# EAGLE design EVALBOARD_001 (EAGLE 7.7.0)

## Sheet 1 of 4
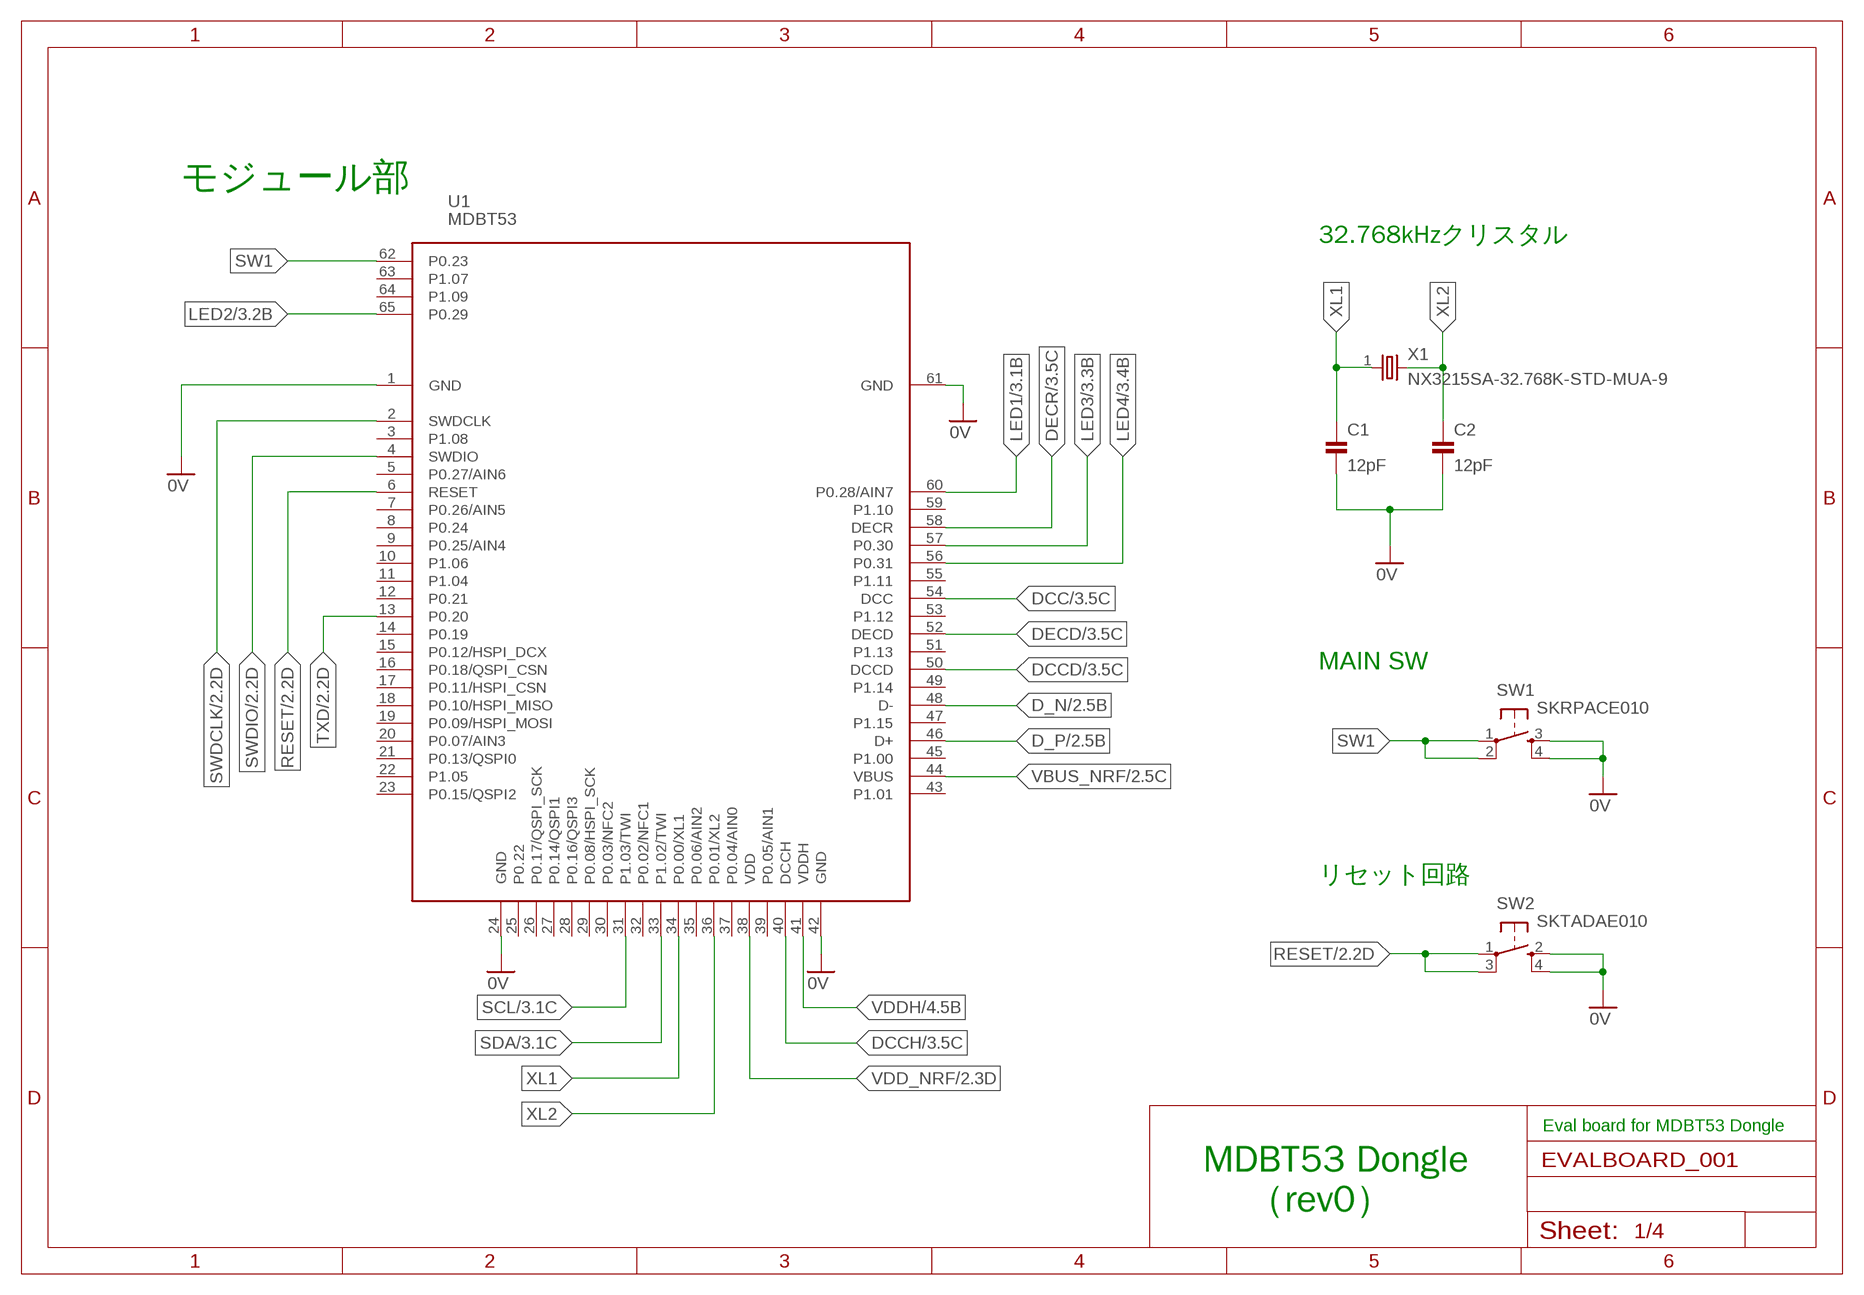
[diagram p0: schematic, sheet 1]

### Parts
C1  12pF  CAP_0603  [C0603K]
C2  12pF  CAP_0603  [C0603K]
SW1  SKRPACE010  [SKRPACE010]
SW2  SKTADAE010  [SKTADAE010]
U1  MDBT53  [MDBT53]
X1  NX3215SA-32.768K-STD-MUA-9  [NX3215]

### Nets
0V: C1.2 C2.2 SW1.3(S) SW1.4(S1) SW2.2(S) SW2.4(S1) U1.1(GND) U1.24(GND) U1.42(GND) U1.61(GND) ; also sheet 2,3,4
D_N: U1.48(D-) ; also sheet 2
D_P: U1.46(D+) ; also sheet 2
DCC: U1.54(DCC) ; also sheet 3
DCCD: U1.50(DCCD) ; also sheet 3
DCCH: U1.40(DCCH) ; also sheet 3
DECD: U1.52(DECD) ; also sheet 3
DECR: U1.58(DECR) ; also sheet 3
LED1: U1.60(P0.28/AIN7) ; also sheet 3
LED2: U1.65(P0.29) ; also sheet 3
LED3: U1.57(P0.30) ; also sheet 3
LED4: U1.56(P0.31) ; also sheet 3
RESET: SW2.1(P) SW2.3(P1) U1.6(RESET) ; also sheet 2
SCL: U1.31(P1.03/TWI) ; also sheet 3
SDA: U1.33(P1.02/TWI) ; also sheet 3
SW1: SW1.1(P) SW1.2(P1) U1.62(P0.23)
SWDCLK: U1.2(SWDCLK) ; also sheet 2
SWDIO: U1.4(SWDIO) ; also sheet 2
TXD: U1.13(P0.20) ; also sheet 2
VBUS_NRF: U1.44(VBUS) ; also sheet 2
VDD_NRF: U1.38(VDD) ; also sheet 2,3,4
VDDH: U1.41(VDDH) ; also sheet 4
XL1: C1.1 U1.34(P0.00/XL1) X1.1
XL2: C2.1 U1.36(P0.01/XL2) X1.2
Unconnected: U1.3(P1.08) U1.5(P0.27/AIN6) U1.7(P0.26/AIN5) U1.8(P0.24) U1.9(P0.25/AIN4) U1.10(P1.06) U1.11(P1.04) U1.12(P0.21) U1.14(P0.19) U1.15(P0.12/HSPI_DCX) U1.16(P0.18/QSPI_CSN) U1.17(P0.11/HSPI_CSN) U1.18(P0.10/HSPI_MISO) U1.19(P0.09/HSPI_MOSI) U1.20(P0.07/AIN3) U1.21(P0.13/QSPI0) U1.22(P1.05) U1.23(P0.15/QSPI2) U1.25(P0.22) U1.26(P0.17/QSPI_SCK) U1.27(P0.14/QSPI1) U1.28(P0.16/QSPI3) U1.29(P0.08/HSPI_SCK) U1.30(P0.03/NFC2) U1.32(P0.02/NFC1) U1.35(P0.06/AIN2) U1.37(P0.04/AIN0) U1.39(P0.05/AIN1) U1.43(P1.01) U1.45(P1.00) U1.47(P1.15) U1.49(P1.14) U1.51(P1.13) U1.53(P1.12) U1.55(P1.11) U1.59(P1.10) U1.63(P1.07) U1.64(P1.09)

### Notes on the sheet
- モジュール部
- 32.768kHzクリスタル
- MAIN SW
- リセット回路
- Eval board for MDBT53 Dongle
- MDBT53 Dongle
      （rev0）

## Sheet 2 of 4
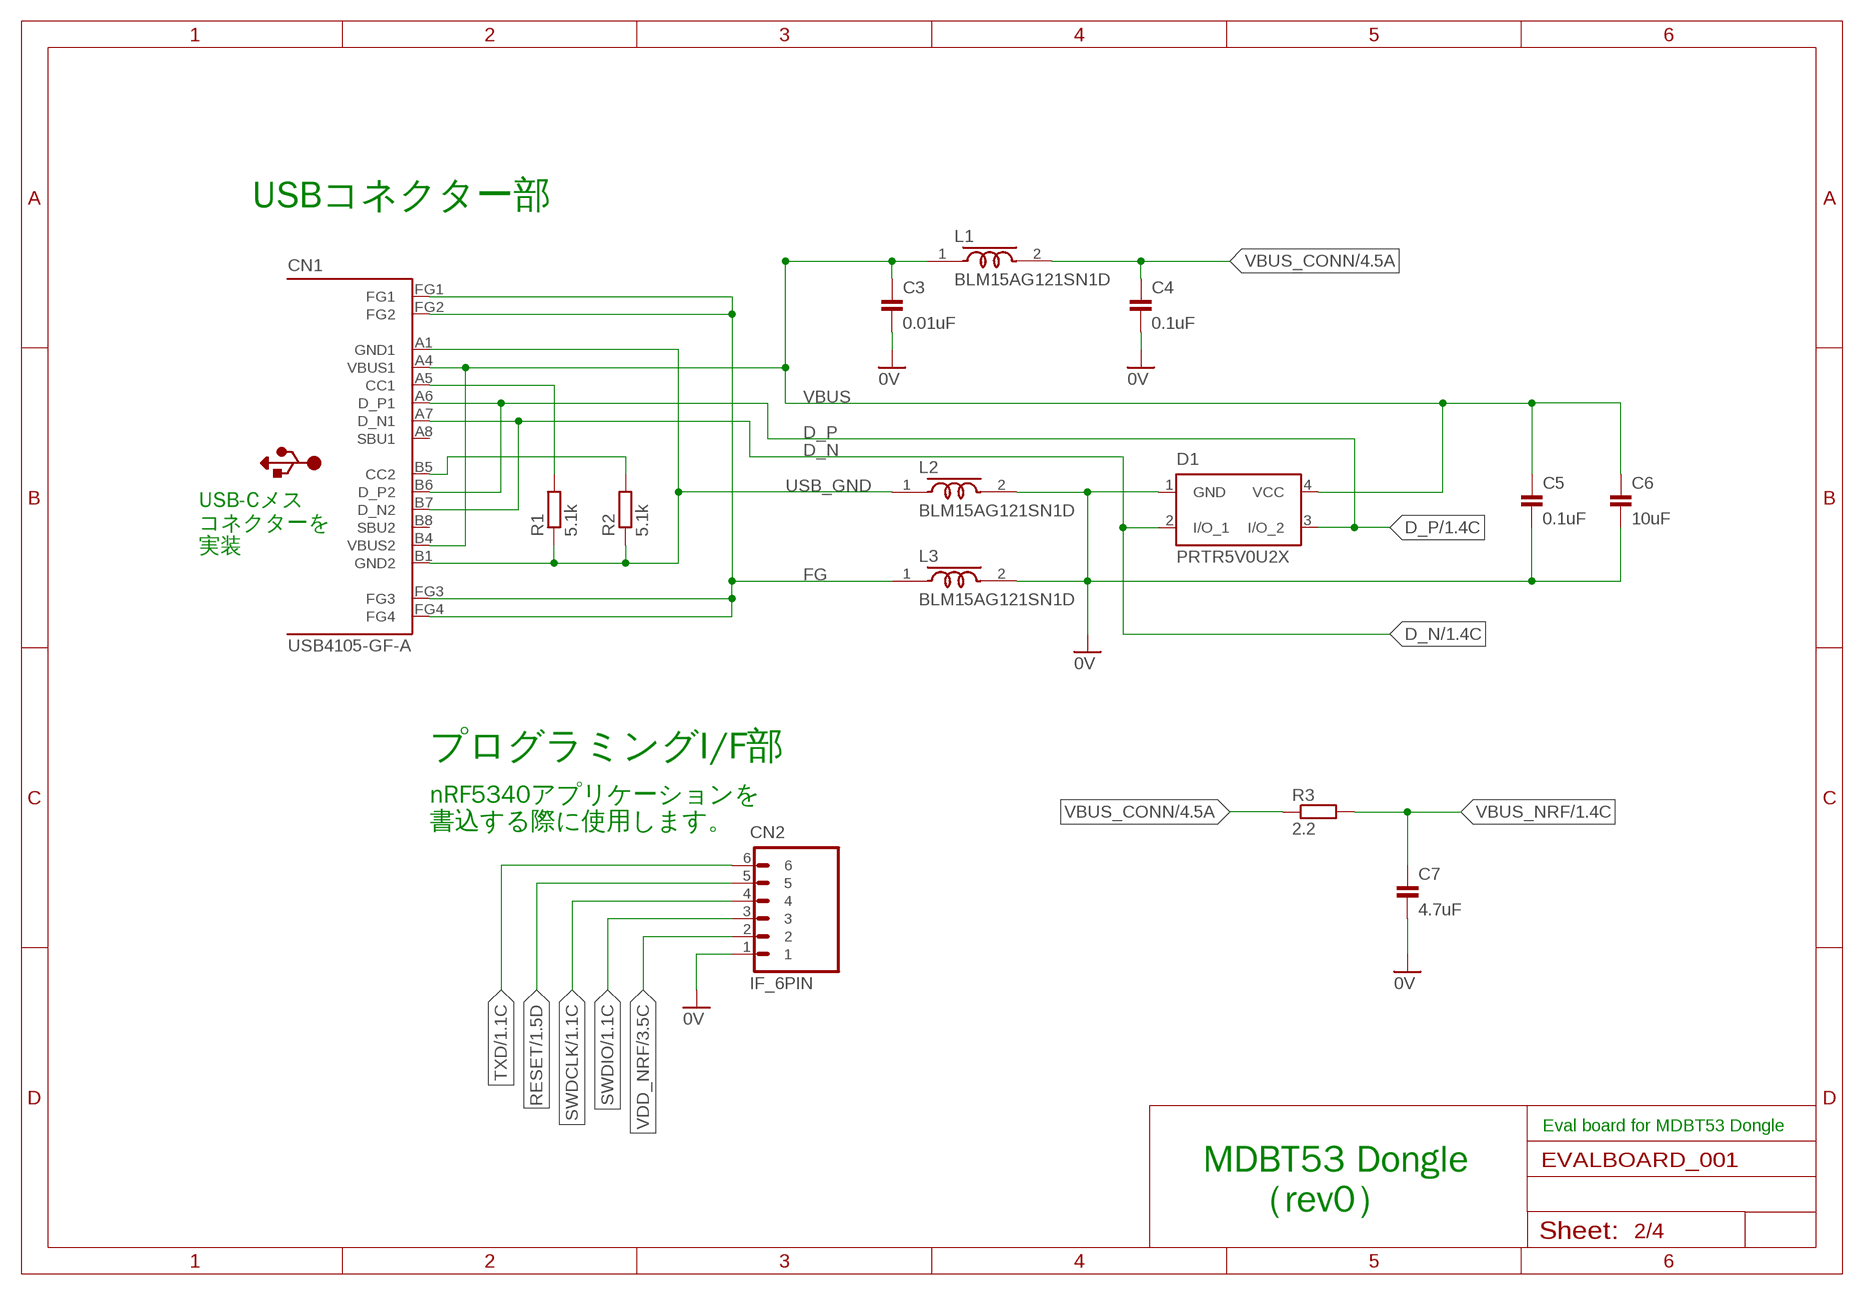
[diagram p1: schematic, sheet 2]

### Parts
C3  0.01uF  CAP_0402K  [C0402K]
C4  0.1uF  CAP_0402K  [C0402K]
C5  0.1uF  CAP_0402K  [C0402K]
C6  10uF  CAP_0603  [C0603K]
C7  4.7uF  CAP_0603  [C0603K]
CN1  USB4105-GF-A  [USB4105-GF-A]
CN2  IF_6PIN  [HEADER_6PIN]
D1  PRTR5V0U2X  [SOT143B]
L1  BLM15AG121SN1D  [C0402K]
L2  BLM15AG121SN1D  [C0402K]
L3  BLM15AG121SN1D  [C0402K]
R1  5.1k  RESISTOR_0402N  [R0402N]
R2  5.1k  RESISTOR_0402N  [R0402N]
R3  2.2  RESISTOR_0402  [R0402]

### Nets
0V: C3.2 C4.2 C5.2 C6.2 C7.2 CN2.1 D1.1(GND) L2.2 L3.2 ; also sheet 1,3,4
D_N: CN1.A7(D_N1) CN1.B7(D_N2) D1.2(I/O_1) ; also sheet 1
D_P: CN1.A6(D_P1) CN1.B6(D_P2) D1.3(I/O_2) ; also sheet 1
FG: CN1.FG1 CN1.FG2 CN1.FG3 CN1.FG4 L3.1
N$2: CN1.A5(CC1) R1.2
N$3: CN1.B5(CC2) R2.2
RESET: CN2.5 ; also sheet 1
SWDCLK: CN2.4 ; also sheet 1
SWDIO: CN2.3 ; also sheet 1
TXD: CN2.6 ; also sheet 1
USB_GND: CN1.A1(GND1) CN1.B1(GND2) L2.1 R1.1 R2.1
VBUS: C3.1 C5.1 C6.1 CN1.A4(VBUS1) CN1.B4(VBUS2) D1.4(VCC) L1.1
VBUS_CONN: C4.1 L1.2 R3.1 ; also sheet 4
VBUS_NRF: C7.1 R3.2 ; also sheet 1
VDD_NRF: CN2.2 ; also sheet 1,3,4
Unconnected: CN1.A8(SBU1) CN1.B8(SBU2)

### Notes on the sheet
- USBコネクター部
- USB-Cメス
  コネクターを
  実装
- プログラミングI/F部
- nRF5340アプリケーションを
  書込する際に使用します。
- Eval board for MDBT53 Dongle
- MDBT53 Dongle
      （rev0）

## Sheet 3 of 4
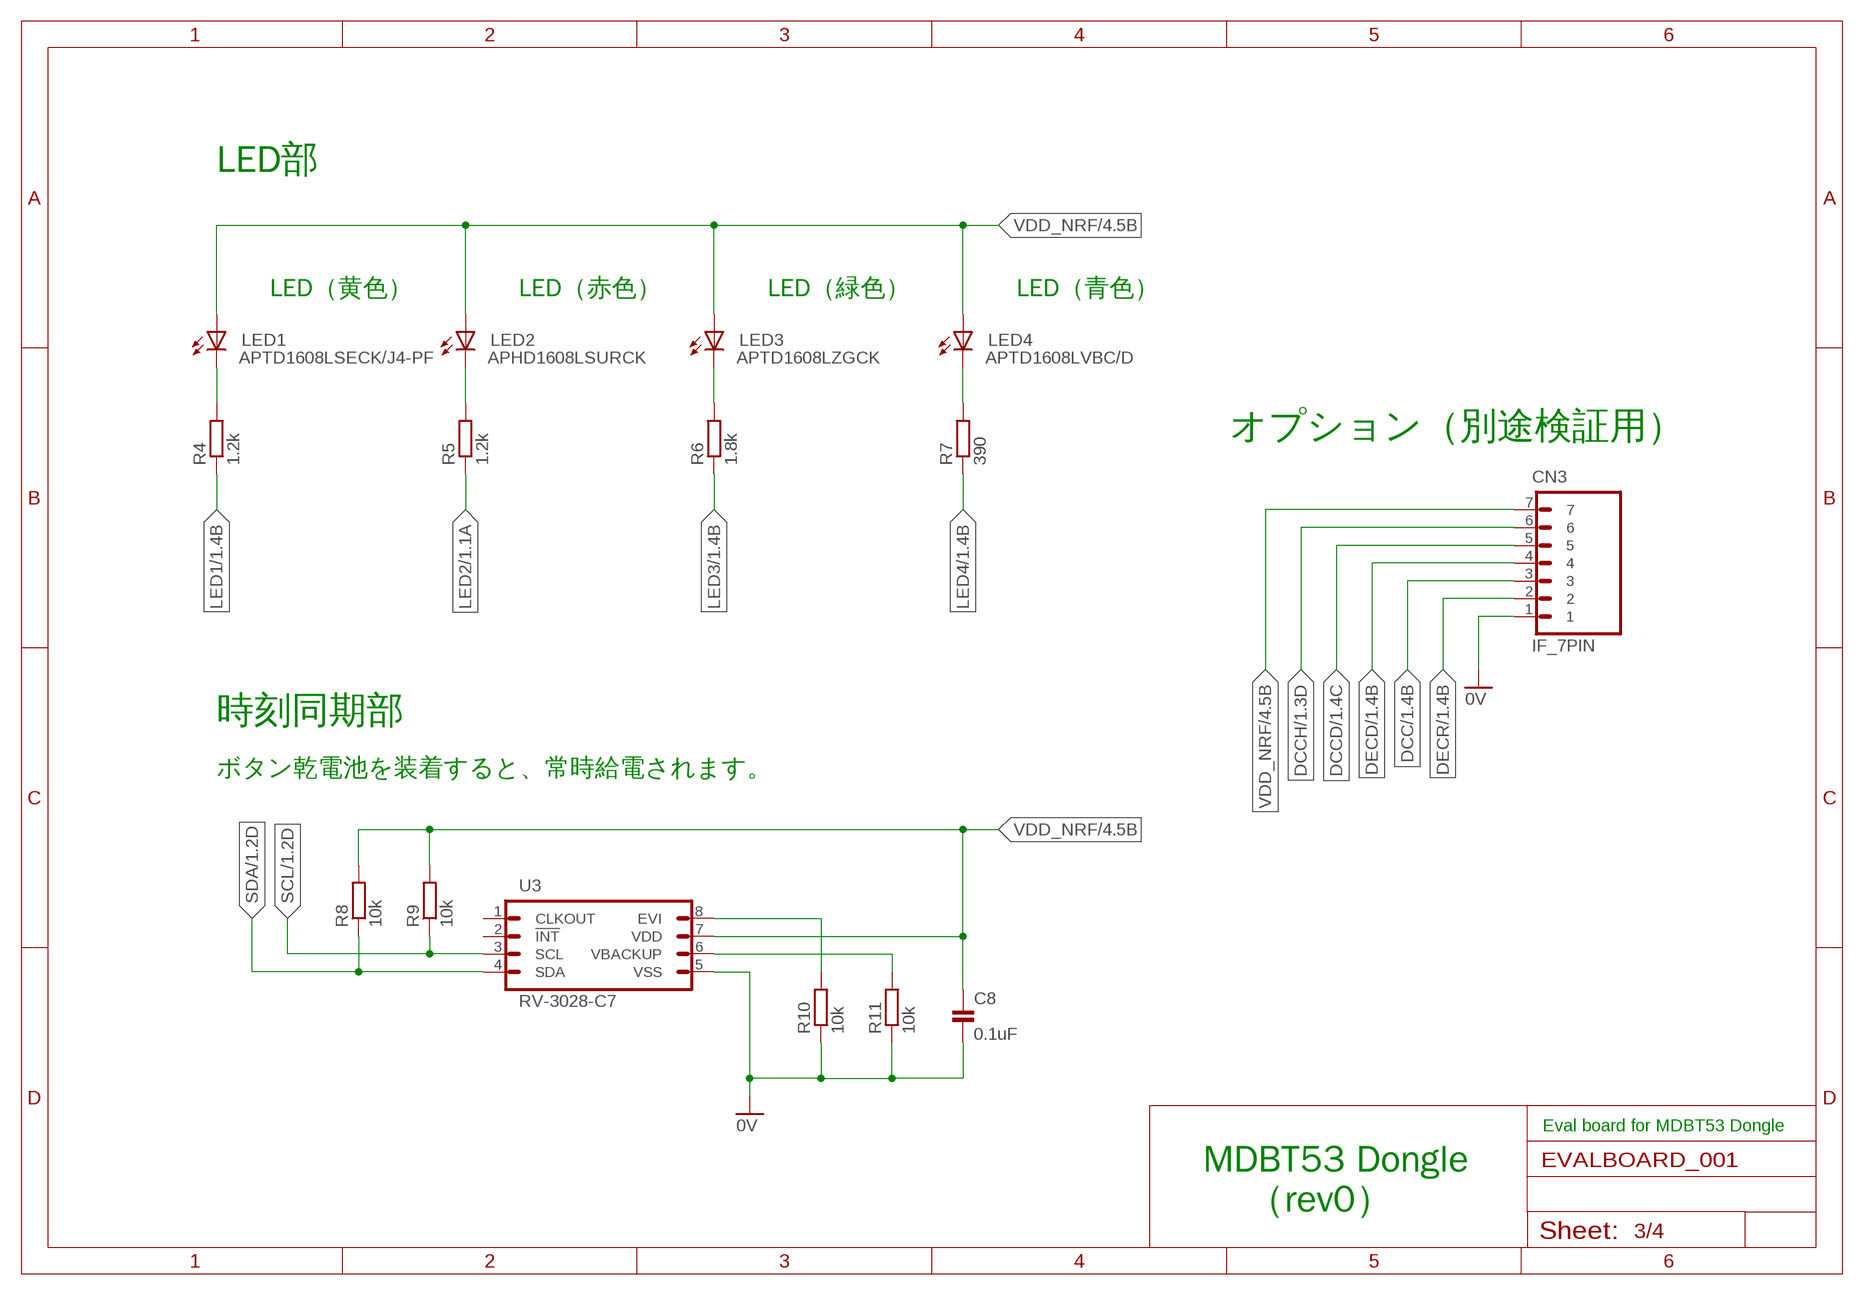
[diagram p2: schematic, sheet 3]

### Parts
C8  0.1uF  CAP_0402K  [C0402K]
CN3  IF_7PIN  [HEADER_7PIN]
LED1  APTD1608LSECK/J4-PF  [APTD1608]
LED2  APHD1608LSURCK  [APTD1608]
LED3  APTD1608LZGCK  [APTD1608]
LED4  APTD1608LVBC/D  [APTD1608]
R4  1.2k  RESISTOR_0402N  [R0402N]
R5  1.2k  RESISTOR_0402N  [R0402N]
R6  1.8k  RESISTOR_0402N  [R0402N]
R7  390  RESISTOR_0402N  [R0402N]
R8  10k  RESISTOR_0402N  [R0402N]
R9  10k  RESISTOR_0402N  [R0402N]
R10  10k  RESISTOR_0402N  [R0402N]
R11  10k  RESISTOR_0402N  [R0402N]
U3  RV-3028-C7  [SON-8]

### Nets
0V: C8.2 CN3.1 R10.1 R11.1 U3.5(VSS) ; also sheet 1,2,4
DCC: CN3.3 ; also sheet 1
DCCD: CN3.5 ; also sheet 1
DCCH: CN3.6 ; also sheet 1
DECD: CN3.4 ; also sheet 1
DECR: CN3.2 ; also sheet 1
LED1: R4.1 ; also sheet 1
LED2: R5.1 ; also sheet 1
LED3: R6.1 ; also sheet 1
LED4: R7.1 ; also sheet 1
N$1: LED4.C R7.2
N$6: LED3.C R6.2
N$7: LED2.C R5.2
N$8: LED1.C R4.2
N$9: R11.2 U3.6(VBACKUP)
N$10: R10.2 U3.8(EVI)
SCL: R9.1 U3.3(SCL) ; also sheet 1
SDA: R8.1 U3.4(SDA) ; also sheet 1
VDD_NRF: C8.1 CN3.7 LED1.A LED2.A LED3.A LED4.A R8.2 R9.2 U3.7(VDD) ; also sheet 1,2,4
Unconnected: U3.1(CLKOUT) U3.2(!INT!)

### Notes on the sheet
- LED部
- LED（黄色） | LED（赤色） | LED（緑色） | LED（青色）
- オプション（別途検証用）
- 時刻同期部
- ボタン乾電池を装着すると、常時給電されます。
- Eval board for MDBT53 Dongle
- MDBT53 Dongle
      （rev0）

## Sheet 4 of 4
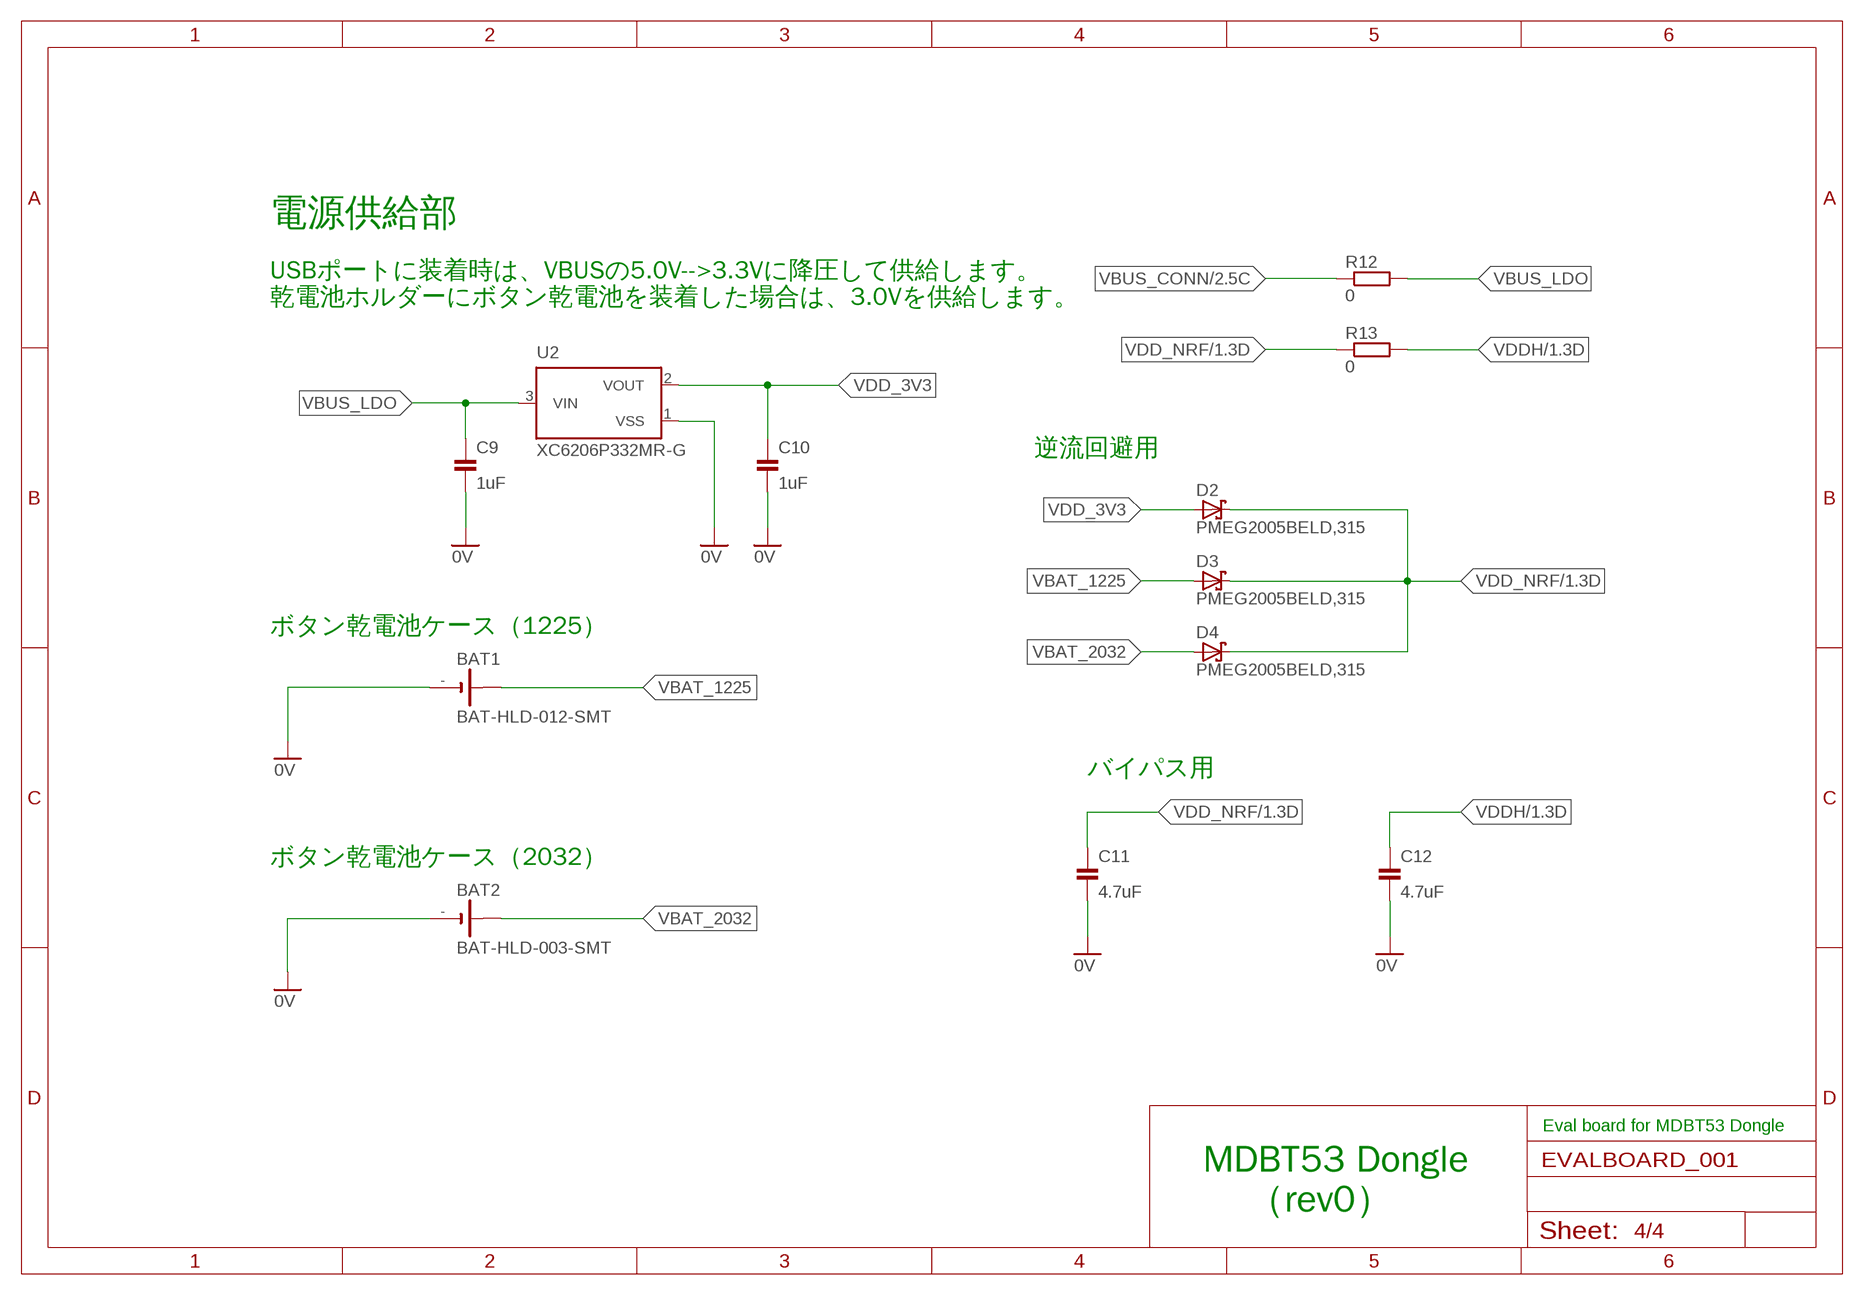
[diagram p3: schematic, sheet 4]

### Parts
BAT1  BAT-HLD-012-SMT  [BAT-HLD-012-SMT]
BAT2  BAT-HLD-003-SMT  [BAT-HLD-003-SMT]
C9  1uF  CAP_0603  [C0603K]
C10  1uF  CAP_0603  [C0603K]
C11  4.7uF  CAP_0603  [C0603K]
C12  4.7uF  CAP_0603  [C0603K]
D2  PMEG2005BELD,315  [DFN1006D-2]
D3  PMEG2005BELD,315  [DFN1006D-2]
D4  PMEG2005BELD,315  [DFN1006D-2]
R12  0  RESISTOR_0603  [R0603]
R13  0  RESISTOR_0603  [R0603]
U2  XC6206P332MR-G  [SOT23]

### Nets
0V: BAT1.- BAT2.- C9.2 C10.2 C11.2 C12.2 U2.1(VSS) ; also sheet 1,2,3
VBAT_1225: BAT1.+@2(+) D3.2(A)
VBAT_2032: BAT2.+@1(+) D4.2(A)
VBUS_CONN: R12.1 ; also sheet 2
VBUS_LDO: C9.1 R12.2 U2.3(VIN)
VDD_3V3: C10.1 D2.2(A) U2.2(VOUT)
VDD_NRF: C11.1 D2.1(C) D3.1(C) D4.1(C) R13.1 ; also sheet 1,2,3
VDDH: C12.1 R13.2 ; also sheet 1

### Notes on the sheet
- 電源供給部
- USBポートに装着時は、VBUSの5.0V-->3.3Vに降圧して供給します。
  乾電池ホルダーにボタン乾電池を装着した場合は、3.0Vを供給します。
- 逆流回避用
- ボタン乾電池ケース（1225）
- バイパス用
- ボタン乾電池ケース（2032）
- Eval board for MDBT53 Dongle
- MDBT53 Dongle
      （rev0）

## Library data of the parts
BAT1 = Connectors:BAT-HLD-012-SMT: ボタン電池ホルダー(CR1216/1225)
BAT2 = Connectors:BAT-HLD-003-SMT: ボタン電池ホルダー(CR2025/2032)
C1-C12 = Parts:CAP: コンデンサー
CN1 = Connectors:USB4105-GF-A: USB Type C Receptacle for USB 2.0
CN2 = Connectors:IF_6PIN: 6-pin インターフェース
CN3 = Connectors:IF_7PIN: 7-pin インターフェース
D1 = Parts:PRTR5V0U2X: ESD protection diode
D2-D4 = Parts:PMEG2005: ショットキーダイオード If - 順電流: 500 mA Vrrm - 繰返し逆電圧: 20 V Vf - 順電圧: 0.39 V Ifsm - 順方向サージ電流: 10 A 最低動作温度: - 65 C 最高動作温度: + 150 C
L1-L3 = Parts:BLM15AG: フェライトビーズ EMIFIL®
LED1 LED3 LED4 = Parts:APTD1608: 発光ダイオード
LED2 = Parts:APHD1608: 発光ダイオード
R1-R13 = Parts:RESISTOR: 抵抗器
SW1 = Parts:SKRPACE010: 表面実装用タクトスイッチ ４．２×３．２ｍｍ小型重作動力タイプ ・作動力：２．５５Ｎ ・操作方向：垂直 ・移動量：０．２ｍｍ ・動作寿命：５０，０００ｃｙｃｌｅｓ （５ｍＡ ５ＶＤＣ） ・初期接触抵抗：最大５００ｍΩ
SW2 = Parts:SKTADAE010: 表面実装用タクトスイッチ 2.6×1.6ｍｍ小型重作動力タイプ ・作動力：2.4 N ・操作方向：垂直 ・移動量：0.11 mm ・定格：50 mA 12 VDC
U1 = Modules:MDBT53: Raytac Corporation Part Number: MDBT53-1M / MDBT53-P1M / MDBT53-U1M Bluetooth Low Energy Module based on Noridc nRF5340 Size: 14.3x9.3mm Source: Raytac datasheet
U2 = Parts:XC6206: 電圧レギュレータ 出力電圧: 3.3 V 出力電流: 200 mA 入力電圧最大値: 6 V 最小入力電圧: 1.8 V 動作供給電流: 1 uA 最低動作温度: - 40 C 最高動作温度: + 85 C
U3 = ICs:RV-3028-C7: Extreme Low Power RTC Module Supply Voltage: 1.2 V 〜 5.5 V Operating Temperature: - 40 C 〜 + 85 C 3.2 mm x 1.5 mm
X1 = Parts:NX3215SA: 水晶振動子 周波数 32.768kHz 周波数公差 ±20ppm 負荷容量 6pF ESR（等価直列抵抗） 70 kOhms 動作温度 -40°C～85°C

## Board
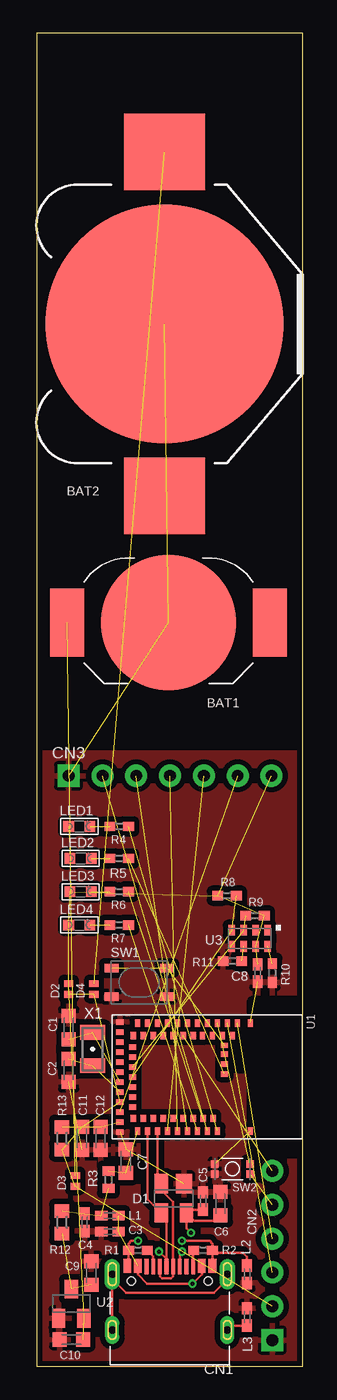
[diagram p4: board, top side]
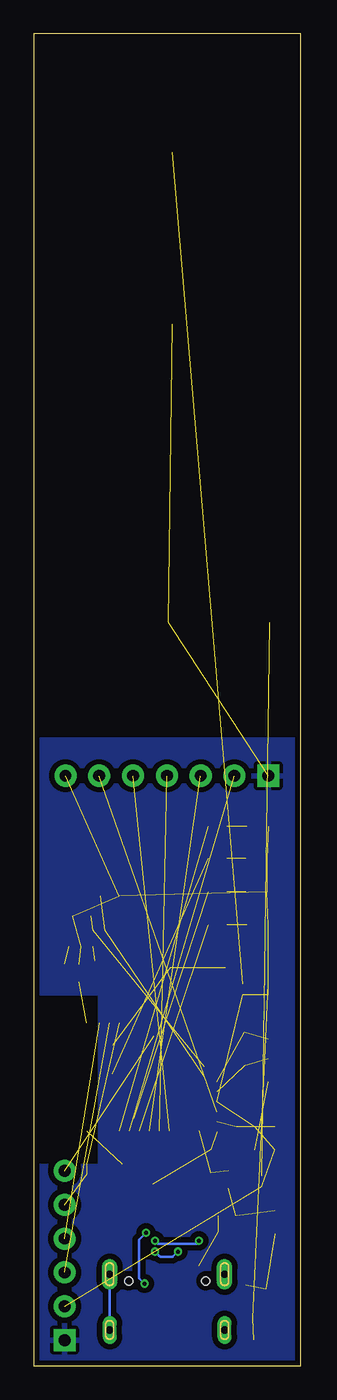
[diagram p5: board, bottom side, seen from below]

Size 20 x 100 mm. Coordinates in mm from the lower left corner, seen from the top.
Outline: 0,0 20,0 20,100 0,100 0,0
Copper layers (1*16): Top 0.035mm / dielectric 1.5mm / Bottom 0.035mm
Design rules "SeeedStudio_2layer_DRU_no_angle_20140221 *": minimum track width 6mil, minimum drill 0.3mm, track to track 6mil, track to pad 6mil, pad to pad 6mil, via to via 6mil, smd to smd 0mil, copper to edge 10mil, drill to drill 10mil, minimum pad ring 10mil, minimum via ring 6mil, stop-mask expansion 2mil, vias tented up to drill 100mil, thermal gap 10mil

### Footprints (pad centres in the part's own frame; a part is rotated, then mirrored left to right if it is on the bottom)
BAT-HLD-012-SMT = smd 2.54 x 5.08: +@1 -7.62,0; +@2 7.62,0 | smd 10.16 x 10.16: - 0,0
BAT-HLD-003-SMT = smd 5.7 x 6.1: +@1 -12.9,0; +@2 12.9,0 | smd 17.9 x 17.9: - 0,0
C0603K = smd 1.05 x 1.08: 1 -0.875,0; 2 0.875,0
C0402K = smd 0.925 x 0.74: 1 -0.65,0; 2 0.65,0
USB4105-GF-A = smd 0.58 x 1.05: A1 -3.2,0.625; A4 -2.4,0.625; B1 3.2,0.625; B4 2.4,0.625 | smd 0.28 x 1.15: A5 -1.25,0.575; A6 -0.25,0.575; A7 0.25,0.575; A8 1.25,0.575; B5 1.75,0.575; B6 0.75,0.575; B7 -0.75,0.575; B8 -1.75,0.575 | drill 0.55 pad 1.15 long: FG1 -4.32,0; FG3 4.32,0 | drill 0.55 pad 1.05 long: FG2 -4.32,-4.18; FG4 4.32,-4.18 | hole 0.6: -2.89,-0.5; 2.89,-0.5
HEADER_6PIN = drill 0.889 pad 1.651 square: 1 -6.35,0 | drill 0.889 pad 1.651: 2 -3.81,0; 3 -1.27,0; 4 1.27,0; 5 3.81,0; 6 6.35,0
HEADER_7PIN = drill 0.889 pad 1.651 square: 1 0,0 | drill 0.889 pad 1.651: 2 2.54,0; 3 5.08,0; 4 7.62,0; 5 10.16,0; 6 12.7,0; 7 15.24,0
SOT143B = smd 1.2 x 1.44: 1 -0.75,-1.1 | smd 1 x 1.44: 2 0.95,-1.1; 3 0.95,1.1; 4 -0.95,1.1
DFN1006D-2 = smd 0.5 x 0.7: 1 -0.4,0; 2 0.4,0
APTD1608 = smd 0.8 x 0.8: A -0.8,0; C 0.8,0
R0402N = smd 0.8 x 0.7: 1 -0.7,0; 2 0.7,0
R0402 = smd 0.7 x 0.9: 1 -0.65,0; 2 0.65,0
R0603 = smd 1 x 1.1: 1 -0.85,0; 2 0.85,0
SKRPACE010 = smd 1.05 x 0.65: 1 -2.075,1.075; 2 2.075,1.075; 3 -2.075,-1.075; 4 2.075,-1.075
SKTADAE010 = smd 0.55 x 0.55: 1 -1.325,0.375; 2 1.325,0.375; 3 -1.325,-0.375; 4 1.325,-0.375
MDBT53 = smd 0.55 x 0.4: 1 -4.05,3.25; 2 -4.05,2.275; 3 -3.1,1.9; 4 -4.05,1.525; 5 -3.1,1.15; 6 -4.05,0.775; 7 -3.1,0.4; 8 -4.05,0.025; 9 -3.1,-0.35; 10 -4.05,-0.725; 11 -3.1,-1.05; 12 -4.05,-1.475; 13 -3.1,-1.8; 14 -4.05,-2.225; 15 -3.1,-2.55; 16 -4.05,-2.975; 17 -3.1,-3.3; 18 -4.05,-3.725; 19 -3.1,-4.05; 20 -4.05,-4.475; 21 -3.1,-4.8; 22 -4.05,-5.225; 23 -3.1,-5.55; 43 3.1,-5.55; 44 4.05,-5.225; 45 3.1,-4.8; 46 4.05,-4.475; 47 3.1,-4.05; 48 4.05,-3.725; 49 3.1,-3.3; 50 4.05,-2.975; 51 3.1,-2.55; 52 4.05,-2.225; 53 3.1,-1.8; 54 4.05,-1.475; 55 3.1,-1.05; 56 4.05,-0.725; 57 3.1,-0.3; 58 4.05,0.025; 59 3.1,0.45; 60 4.05,0.775; 61 4.05,3.25 | smd 0.4 x 0.55: 24 -4.125,-6.55; 25 -3.375,-6.55; 26 -2.625,-6.55; 27 -2.25,-5.6; 28 -1.875,-6.55; 29 -1.5,-5.6; 30 -1.125,-6.55; 31 -0.75,-5.6; 32 -0.375,-6.55; 33 0,-5.6; 34 0.375,-6.55; 35 0.75,-5.6; 36 1.125,-6.55; 37 1.5,-5.6; 38 1.875,-6.55; 39 2.25,-5.6; 40 2.625,-6.55; 41 3.375,-6.55; 42 4.125,-6.55; 62 -2.375,1.3; 63 -1.725,1.3; 64 -0.975,1.3; 65 -0.225,1.3
SOT23 = smd 1 x 1.4: 1 -0.95,-1.1; 2 0.95,-1.1; 3 0,1.1
SON-8 = smd 0.5 x 0.8: 1 0.25,0.4; 2 1.15,0.4; 3 2.05,0.4; 4 2.95,0.4; 5 2.95,1.6; 6 2.05,1.6; 7 1.15,1.6; 8 0.25,1.6
NX3215 = smd 1.1 x 1.9: 1 -1.25,0; 2 1.25,0

### Placement (x,y rotation side)
BAT1  9.9,55.8 180 top
BAT2  9.6,78.2 270 top
C1  2.4,25.4 90 top
C2  2.4,22.2 270 top
C3  5.5,10.1 180 top
C4  3.6,10.8 270 top
C5  12.5,12.4 90 top
C6  13.8,12.2 90 top
C7  6.7,15.4 90 top
C8  16.6,29.5 270 top
C9  4.1,7 90 top
C10  2.6,2 180 top
C11  3.4,17.1 270 top
C12  4.8,17.1 270 top
CN1  10,6.9 0 top
CN2  17.7,8.3 90 top
CN3  2.4,44.3 0 top
D1  10.3,12.6 180 top
D2  2.4,28.3 90 top
D3  2.9,13.9 90 top
D4  4.3,28.3 90 top
L1  5.5,11.3 180 top
L2  15.8,6.9 270 top
L3  15.8,3.7 90 top
LED1  3.2,40.5 0 top
LED2  3.3,38.1 0 top
LED3  3.3,35.6 0 top
LED4  3.2,33.1 0 top
R1  7.6,8.7 0 top
R2  12.5,8.7 180 top
R3  5.4,14 90 top
R4  6.2,40.5 180 top
R5  6.2,38.1 180 top
R6  6.2,35.6 180 top
R7  6.2,33.1 180 top
R8  14.3,35.3 180 top
R9  16.4,33.8 0 top
R10  17.7,29.5 90 top
R11  14.7,30.4 0 top
R12  1.9,10.8 270 top
R13  1.9,17.1 90 top
SW1  7.7,28.8 0 top
SW2  14.7,14.8 180 top
U1  12.8,21.7 270 top
U2  2.6,4.7 0 top
U3  17.6,33.1 180 top
X1  4.2,23.8 270 top

### Tracks (layer width: path | path; a pad name or v marks a point on that pad's centre or on a via)
0V  (7 unrouted)
  pour Top (isolate 0.406, rank 3): 21,-1 21,46 -1,46 -1,-1
  pour Bottom (isolate 0.406, rank 3): -2,47 22,47 22,28 15,28 15,15 22,15 22,-2 -2,-2
D_N
  Top 0.203: U1.48 9.07,13.97 D1.2 9.35,13.25 10.25,12.35 CN1.A7 10.25,6.75 10.1,6.6 9.4,6.6 9.25,6.75 CN1.B7
D_P  (via drill 0.3)
  Top 0.203: U1.46 8.32,12.53 D1.3 9.75,11.1 CN1.A6 9.75,8.05 v9.2,8.6 | CN1.B6 10.75,8.45 v10.9,8.6
  Bottom 0.203: 10.6,8.3 v10.9,8.6 10.5,8.2 9.6,8.2 v9.2,8.6
DCC  (1 unrouted)
DCCD  (1 unrouted)
DCCH  (1 unrouted)
DECD  (1 unrouted)
DECR  (1 unrouted)
FG
  Top 0.203: L3.1 14.65,3.05 CN1.FG4 | CN1.FG3 14.32,6.52 13.3,5.5 6.7,5.5 5.68,6.52 CN1.FG1 CN1.FG2
  Bottom 0.203: CN1.FG4 CN1.FG3
LED1  (1 unrouted)
LED2  (1 unrouted)
LED3  (1 unrouted)
LED4  (1 unrouted)
N$1  (1 unrouted)
N$2
  Top 0.203: CN1.A5 8.75,8.25 R1.2
N$3
  Top 0.203: CN1.B5 11.75,8.65 R2.2
N$6  (1 unrouted)
N$7  (1 unrouted)
N$8  (1 unrouted)
N$9  (1 unrouted)
N$10  (1 unrouted)
RESET  (3 unrouted)
SCL  (2 unrouted)
SDA  (2 unrouted)
SW1  (2 unrouted)
SWDCLK  (1 unrouted)
SWDIO  (1 unrouted)
TXD  (1 unrouted)
USB_GND  (via drill 0.3)
  Top 0.203: CN1.B1 R2.1 | v7.6,9.4 7.1,9.4 6.9,9.2 R1.1 6.9,7.62 CN1.A1 | R2.1 13.2,9.2 13,9.4 v10.9,9.4 | L2.1 15.8,8.2 15.5,8.5 13.4,8.5 R2.1
  Bottom 0.203: v7.6,9.4 7.8,9.2 10.7,9.2 v10.9,9.4
VBAT_1225  (1 unrouted)
VBAT_2032  (1 unrouted)
VBUS  (via drill 0.3)  (2 unrouted)
  Top 0.203: CN1.A4 7.6,6.9 8.3,6.2 v11.7,6.2 12.4,6.9 CN1.B4 | C6.1 13.38,10.9 11.85,10.9 D1.4 | C5.1 11.5,11.75 D1.4 | D1.4 11.25,10.35 v11.6,10
  Bottom 0.203: v11.6,10 12.1,9.5 12.1,6.6 v11.7,6.2
VBUS_CONN  (3 unrouted)
VBUS_LDO  (2 unrouted)
VBUS_NRF  (2 unrouted)
VDD_3V3  (2 unrouted)
VDD_NRF  (15 unrouted)
VDDH  (2 unrouted)
XL1  (2 unrouted)
XL2  (2 unrouted)